# Altium project Clock_Led7_23.PrjPcb
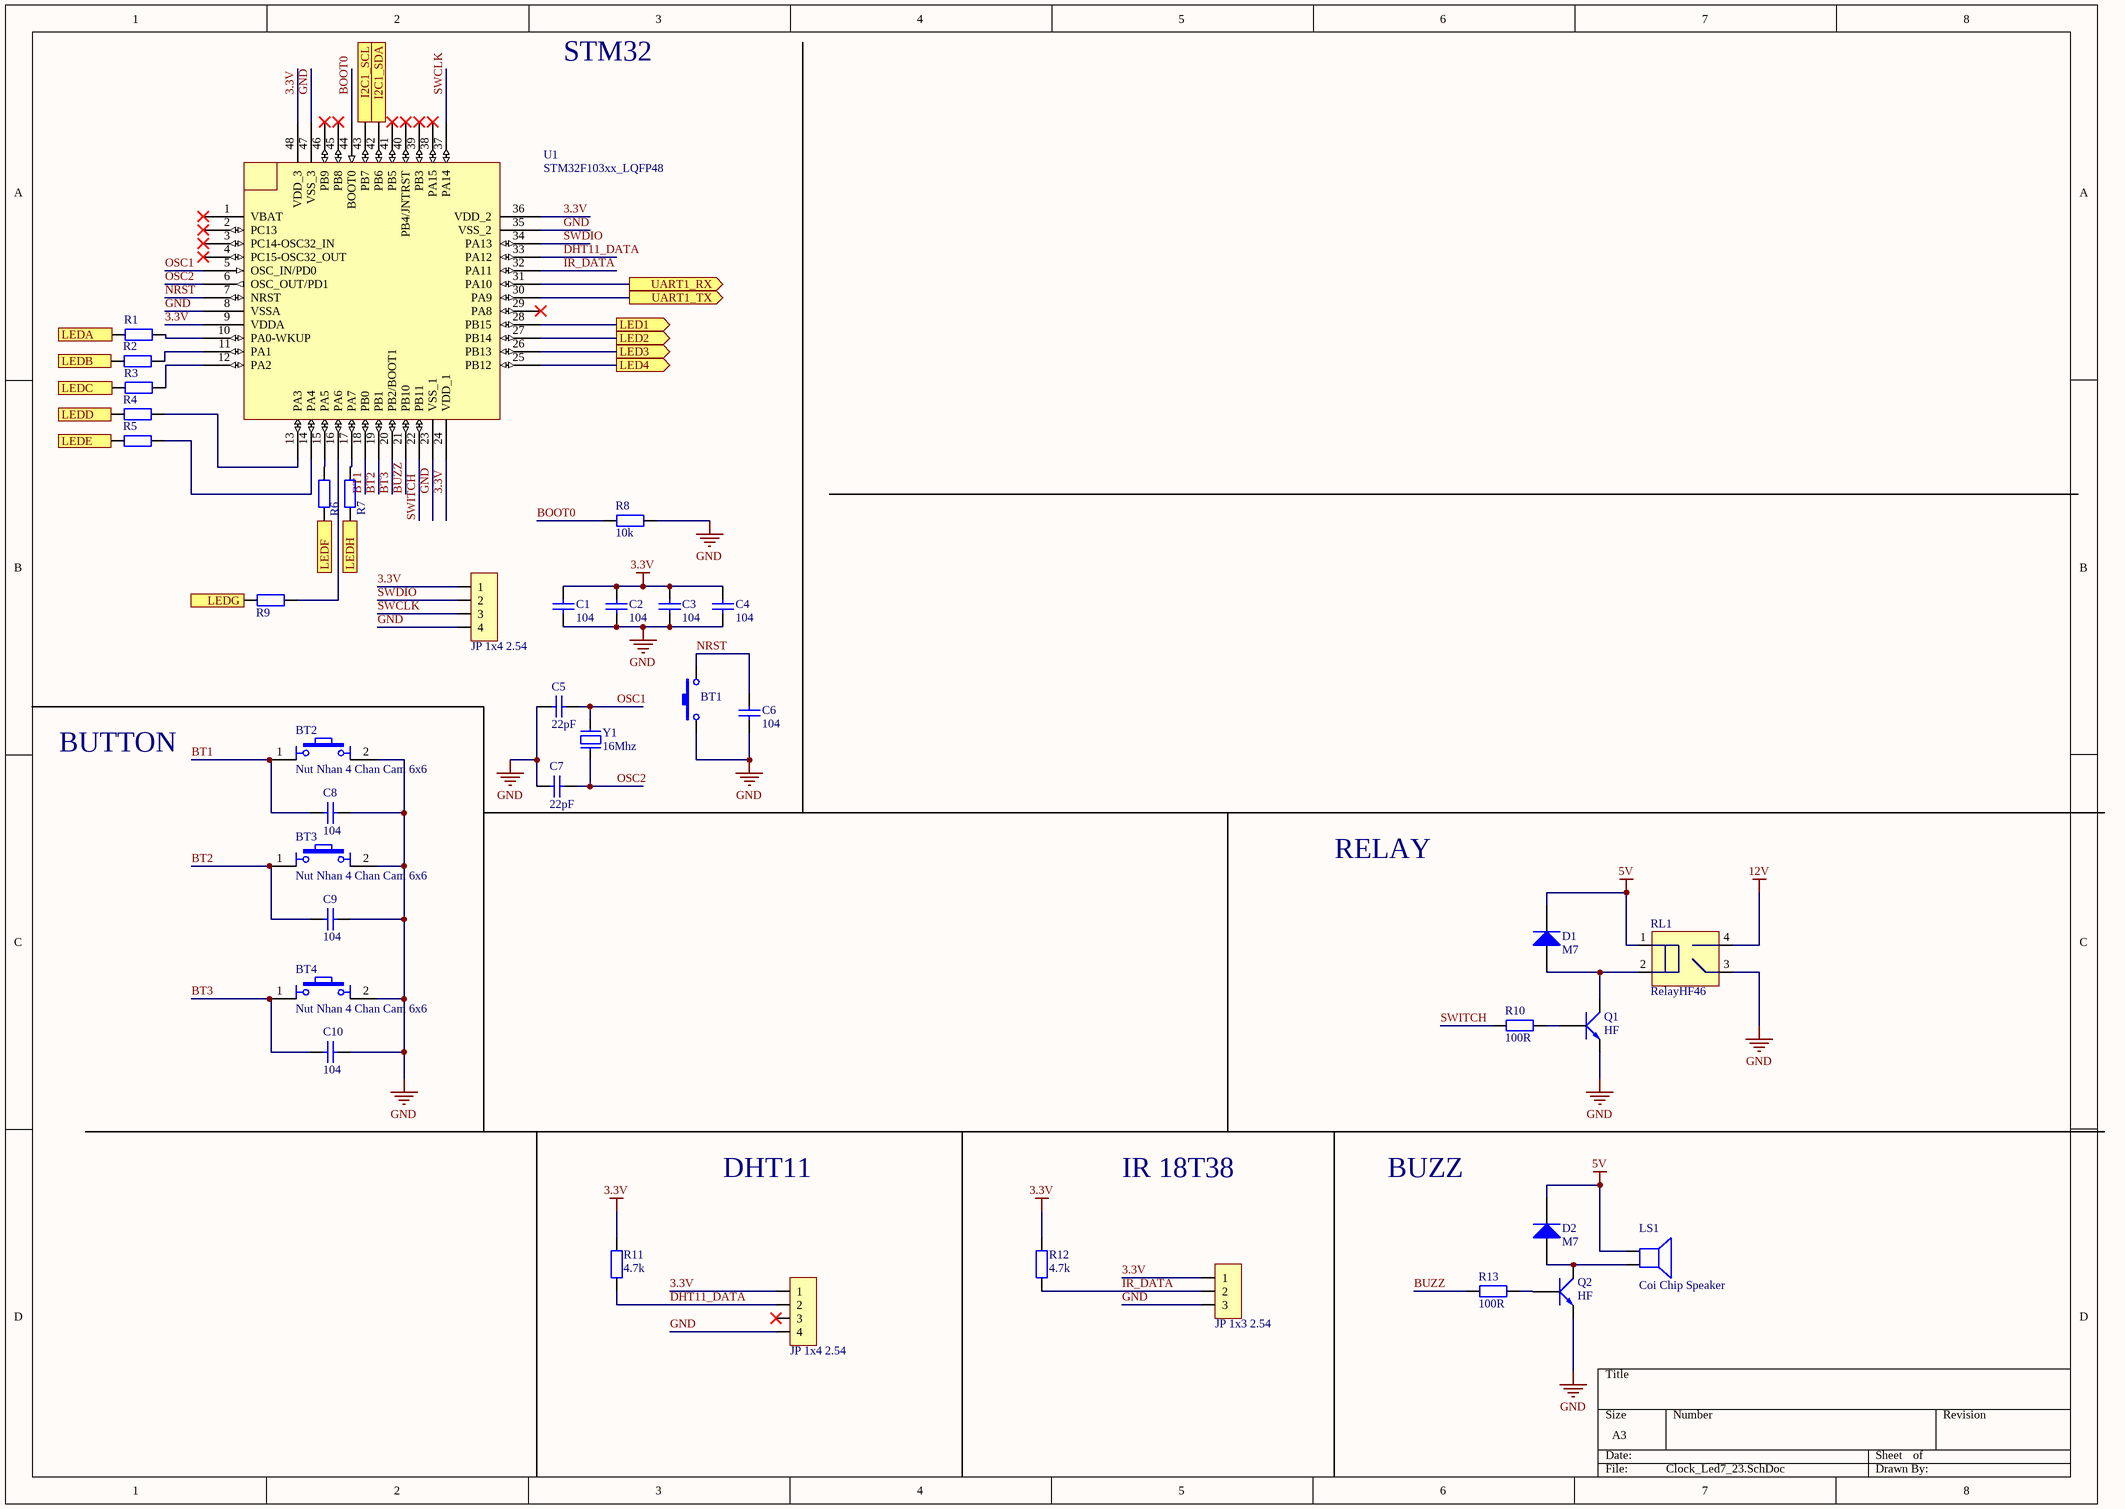
[diagram p0: Clock_Led7_23.SchDoc]
5 sheets, 69 parts. Net scope: flat (ports and power ports of the same name join across sheets).
Board file: Clock_Led7_23.PcbDoc
Sheets:
  Clock_Led7_23.SchDoc
  led7.SchDoc
  DS3231.SchDoc
  ESP8266.SchDoc
  POWER.SchDoc

## Sheet Clock_Led7_23.SchDoc
size A3; SheetNumber: 1; SheetTotal: 1

### Parts
BT1  Nut Nhan 2 Chan SMD 3x6x2.5  [Nut Nhan 2 Chan SMD 3x6x2.5]  (value not drawn)
BT2  Nut Nhan 4 Chan Cam 6x6  [Nut Nhan 4 Chan Cam 6x6]
BT3  Nut Nhan 4 Chan Cam 6x6  [Nut Nhan 4 Chan Cam 6x6]
BT4  Nut Nhan 4 Chan Cam 6x6  [Nut Nhan 4 Chan Cam 6x6]
C1  104  [tu 0805]
C2  104  [tu 0805]
C3  104  [tu 0805]
C4  104  [tu 0805]
C5  22pF  [tu 0805]
C6  104  [tu 0805]
C7  22pF  [tu 0805]
C8  104  [tu 0805]
C9  104  [tu 0805]
C10  104  [tu 0805]
D1  M7  [DIODE SMA]
D2  M7  [DIODE SMA]
JP1  JP 1x4 2.54  [JP 1x4 DT]
JP2  JP 1x3 2.54  [JP 1x3 CT]
JP3  JP 1x4 2.54  [JP 1x4 CT]
LS1  Coi Chip Speaker  [Coi Chip Speacker]
Q1  HF  [SOT23]
Q2  HF  [SOT23]
R1  100R  [tro smd 0805]  (value not drawn)
R2  100R  [tro smd 0805]  (value not drawn)
R3  100R  [tro smd 0805]  (value not drawn)
R4  100R  [tro smd 0805]  (value not drawn)
R5  100R  [tro smd 0805]  (value not drawn)
R6  100R  [tro smd 0805]  (value not drawn)
R7  100R  [tro smd 0805]  (value not drawn)
R8  10k  [tro smd 0805]
R9  100R  [tro smd 0805]  (value not drawn)
R10  100R  [tro smd 0805]
R11  4.7k  [tro smd 0805]
R12  4.7k  [tro smd 0805]
R13  100R  [tro smd 0805]
RL1  RelayHF46  [Relay 4 chan HF46F]
U1  STM32F103xx_LQFP48  [STM32_LQPF48]
Y1  16Mhz  [Thach Anh 2 chan SMD]

### Ports
I2C1_SCL (out), I2C1_SDA (out), LED1 (out), LED2 (out), LED3 (out), LED4 (out), LEDA (out), LEDB (out), LEDC (out), LEDD (out), LEDE (out), LEDF (out), LEDG (out), LEDH (out), UART1_RX (out), UART1_TX (out)

### Nets
3.3V: C1.1 C2.1 C3.1 C4.1 JP1.1 JP2.1 JP3.1 R11.2 R12.2 U1.9(VDDA) U1.24(VDD_1) U1.36(VDD_2) U1.48(VDD_3)
5V: D1.2(K) D2.2(K) LS1.1 RL1.1
12V: RL1.4(AC/DC)
GND: BT1.1 BT2.2 BT3.2 BT4.2 C1.2 C2.2 C3.2 C4.2 C5.2 C6.2 C7.1 C8.2 C9.2 C10.2 JP1.4 JP2.3 JP3.4 Q1.2(E) Q2.2(E) R8.1 RL1.3(AC/DC) U1.8(VSSA) U1.23(VSS_1) U1.35(VSS_2) U1.47(VSS_3)
BOOT0: R8.2 U1.44(BOOT0)
BT1: BT2.1 C8.1 U1.18(PB0)
BT2: BT3.1 C9.1 U1.19(PB1)
BT3: BT4.1 C10.1 U1.20(PB2/BOOT1)
BUZZ: R13.1 U1.21(PB10)
DHT11_DATA: JP3.2 R11.1 U1.33(PA12)
IR_DATA: JP2.2 R12.1 U1.32(PA11)
NRST: BT1.2 C6.1 U1.7(NRST)
OSC1: C5.1 U1.5(OSC_IN/PD0) Y1.2
OSC2: C7.2 U1.6(OSC_OUT/PD1) Y1.1
SWCLK: JP1.3 U1.37(PA14)
SWDIO: JP1.2 U1.34(PA13)
SWITCH: R10.1 U1.22(PB11)
NetD1_1: D1.1(A) Q1.3(C) RL1.2
NetD2_1: D2.1(A) LS1.2 Q2.3(C)
NetL1_2: R5.1 ; port LEDE
NetL1_3: R4.1 ; port LEDD
NetL1_4: R3.1 ; port LEDC
NetL1_6: R2.1 ; port LEDB
NetL1_7: R1.1 ; port LEDA
NetL1_8: R7.1 ; port LEDH
NetL1_9: R6.1 ; port LEDF
NetL1_10: R9.2 ; port LEDG
NetMD1_1: U1.30(PA9) ; port UART1_TX
NetMD1_8: U1.31(PA10) ; port UART1_RX
NetQ1_1: Q1.1(B) R10.2
NetQ2_1: Q2.1(B) R13.2
NetR1_2: R1.2 U1.10(PA0-WKUP)
NetR2_2: R2.2 U1.11(PA1)
NetR3_2: R3.2 U1.12(PA2)
NetR4_2: R4.2 U1.13(PA3)
NetR5_2: R5.2 U1.14(PA4)
NetR6_2: R6.2 U1.15(PA5)
NetR7_2: R7.2 U1.17(PA7)
NetR9_1: R9.1 U1.16(PA6)
NetR16_1: U1.43(PB7) ; port I2C1_SCL
NetR17_1: U1.42(PB6) ; port I2C1_SDA
NetR18_1: U1.28(PB15) ; port LED1
NetR19_1: U1.27(PB14) ; port LED2
NetR20_1: U1.26(PB13) ; port LED3
NetR21_1: U1.25(PB12) ; port LED4

Not connected (* = marked no-connect by the designer): JP3 3*; U1 1(VBAT)* 2(PC13)* 3(PC14-OSC32_IN)* 4(PC15-OSC32_OUT)* 29(PA8)* 38(PA15)* 39(PB3)* 40(PB4/JNTRST)* 41(PB5)* 45(PB8)* 46(PB9)*

### Notes on the sheet
- STM32
- BUTTON
- RELAY
- DHT11
- IR 18T38
- BUZZ

### Library data of the parts
BT1 = Nut Nhan 2 Chan SMD 3x6x2.5: Ma_Hang: MH001036; Ten: Nút Nhấn 2 Chân 3x6x2.5MM SMD
BT2-BT4 = Nut Nhan 4 Chan Cam 6x6: Nut Nhan 4 Chan 6x6mm; Ten: Nút Nhấn 4 Chân 6x6x5MM DIP; Ma_Hang: MH004584
C1-C4 C6 C8-C10 = Tu 0805 104 50V 10%: Dán; Don_Vi: Con; So_Chan: 2; Ten_Linh_Kien: Tụ 0805 104-100nF 10% 50V; Ma_Hang: MH004551; Chung_Loai: Dán; Kieu_Chan: *
C5 C7 = Tu 0805 22pF 50V 10%: Dán; Don_Vi: Con; So_Chan: 2; Ten_Linh_Kien: Tụ 0805 22P 10% 50V; Ma_Hang: MH004560; Chung_Loai: Dán; Kieu_Chan: *
D1 D2 = Diode M7 ( 4007 ): Dán; Don_Vi: Con; Ten_Linh_Kien: Diode M7 1N4007 SMD 1A 1000V; Ma_Hang: MH000944; Chung_Loai: Dán; Ghi_Chu: *
JP1 = JP 1x4 2.54 Duc Thang: Cắm; Ten_Linh_Kien: Jump Đơn Đực 2.54MM 1x40P Thẳng 11MM; Don_Vi: Con; Ma_Hang: MH000903; Ghi_Chu: *; Kieu_Chan: *; Chung_Loai: Cắm
JP2 = JP 1x3 2.54 Cai Thang: Cắm; Ten_Linh_Kien: Jump Đơn Cái 2.54MM 1x20P Thẳng; Don_Vi: Con; Ma_Hang: MH004006; Ghi_Chu: *; Kieu_Chan: *; Chung_Loai: Cắm
JP3 = JP 1x4 2.54 Cai Thang: Cắm; Ten_Linh_Kien: Jump Đơn Cái 2.54MM 1x20P Thẳng; Don_Vi: Con; Ma_Hang: MH004006; Ghi_Chu: *; Kieu_Chan: *; Chung_Loai: Cắm
LS1 = Coi Chip Speaker: Còi chip
Q1 Q2 = C1815 HF SMD: NPN transistor; Value: C9014
R1-R7 R9 R10 R13 = Tro 0805 5% 100R: Dán; Don_Vi: Con; So_Chan: 2; Ten_Linh_Kien: Trở 0805 5% 100R; Ma_Hang: MH005251; Chung_Loai: Dán; Kieu_Chan: *
R8 = Tro 0805 5% 10k: Dán; Don_Vi: Con; So_Chan: 2; Ten_Linh_Kien: Trở 0805 5% 10k; Ma_Hang: MH005239; Chung_Loai: Dán; Kieu_Chan: *
R11 R12 = Tro 0805 5% 4.7k: Dán; Don_Vi: Con; So_Chan: 2; Ten_Linh_Kien: Trở 0805 5% 4.7k; Ma_Hang: MH005307; Chung_Loai: Dán; Kieu_Chan: *
RL1 = Relay 4 chan HF46F: Ten: Relay 5V5A HF46F-G 5-HS1; Ma_Hang: MH003879
Y1 = Thach Anh 2 chan SMD: Crystal For all Crystal 2pin.; Value: 4Mhz
U1 = STM32F103xx_LQFP48: Published: 30-May-2008; DatasheetVersion: rev6, Mar-2008; PackageVersion: Mar-2008; PackageReference: LQFP48; Publisher: Altium Limited; PackageDescription: 48-Pin Low-Profile Quad Flat Pack, 7 x 7 mm Body, 0.5 mm Pitch (LQFP48); ComponentLink1Description: Manufacturer Link; ComponentLink1URL: www.st.com/stm32; ComponentLink2Description: Datasheet; ComponentLink2URL: http://www.st.com/stonline/products/literature/ds/13587.pdf

## Sheet led7.SchDoc
size A4
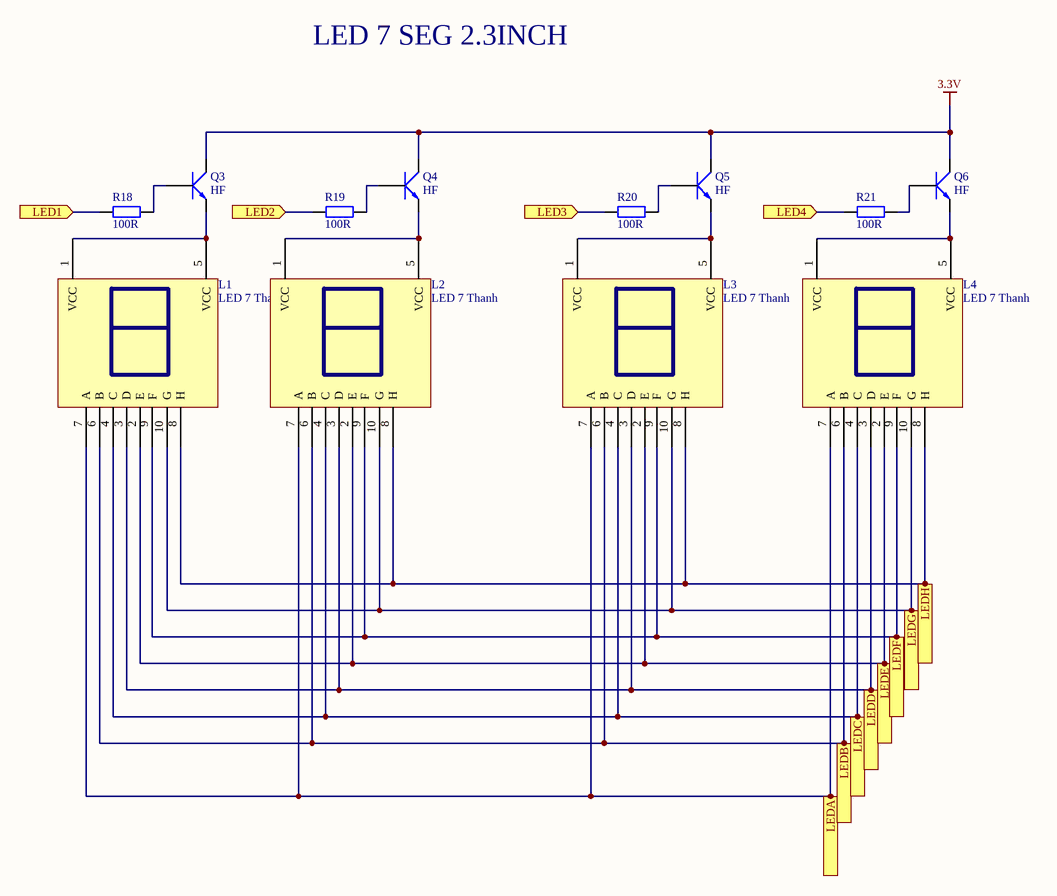
[diagram p1: led7.SchDoc]

### Parts
L1  LED 7 Thanh  [LED7SEG_2.3inch]
L2  LED 7 Thanh  [LED7SEG_2.3inch]
L3  LED 7 Thanh  [LED7SEG_2.3inch]
L4  LED 7 Thanh  [LED7SEG_2.3inch]
Q3  HF  [SOT23]
Q4  HF  [SOT23]
Q5  HF  [SOT23]
Q6  HF  [SOT23]
R18  100R  [tro smd 0805]
R19  100R  [tro smd 0805]
R20  100R  [tro smd 0805]
R21  100R  [tro smd 0805]

### Ports
LED1 (in), LED2 (in), LED3 (in), LED4 (in), LEDA (in), LEDB (in), LEDC (in), LEDD (in), LEDE (in), LEDF (in), LEDG (in), LEDH (in)

### Nets
3.3V: Q3.3(C) Q4.3(C) Q5.3(C) Q6.3(C)
NetL1_2: L1.2(E) L2.2(E) L3.2(E) L4.2(E) ; port LEDE
NetL1_3: L1.3(D) L2.3(D) L3.3(D) L4.3(D) ; port LEDD
NetL1_4: L1.4(C) L2.4(C) L3.4(C) L4.4(C) ; port LEDC
NetL1_5: L1.5(VCC) Q3.2(E)
NetL1_6: L1.6(B) L2.6(B) L3.6(B) L4.6(B) ; port LEDB
NetL1_7: L1.7(A) L2.7(A) L3.7(A) L4.7(A) ; port LEDA
NetL1_8: L1.8(H) L2.8(H) L3.8(H) L4.8(H) ; port LEDH
NetL1_9: L1.9(F) L2.9(F) L3.9(F) L4.9(F) ; port LEDF
NetL1_10: L1.10(G) L2.10(G) L3.10(G) L4.10(G) ; port LEDG
NetL2_5: L2.5(VCC) Q4.2(E)
NetL3_5: L3.5(VCC) Q5.2(E)
NetL4_1: L4.1(VCC) L4.5(VCC) Q6.2(E)
NetQ3_1: Q3.1(B) R18.2
NetQ4_1: Q4.1(B) R19.2
NetQ5_1: Q5.1(B) R20.2
NetQ6_1: Q6.1(B) R21.2
NetR18_1: R18.1 ; port LED1
NetR19_1: R19.1 ; port LED2
NetR20_1: R20.1 ; port LED3
NetR21_1: R21.1 ; port LED4

Not connected (* = marked no-connect by the designer): L1 1(VCC); L2 1(VCC); L3 1(VCC)

### Notes on the sheet
- LED 7 SEG 2.3INCH

### Library data of the parts
L1-L4 = LED 7x1 2.3inch Anot: Dán; Don_Vi: Con; Ma_Hang: MH000901; Ten_Linh_Kien: Led 7 2.3 1 Số Anot (Sáng Đỏ); Ghi_Chu: *; Kieu_Chan: *; Chung_Loai: Dán
Q3-Q6 = C1815 HF SMD: NPN transistor; Value: C9014
R18-R21 = Tro 0805 5% 100R: as R1 on sheet Clock_Led7_23; Chung_Loai: Dán; Kieu_Chan: *

## Sheet DS3231.SchDoc
size A4
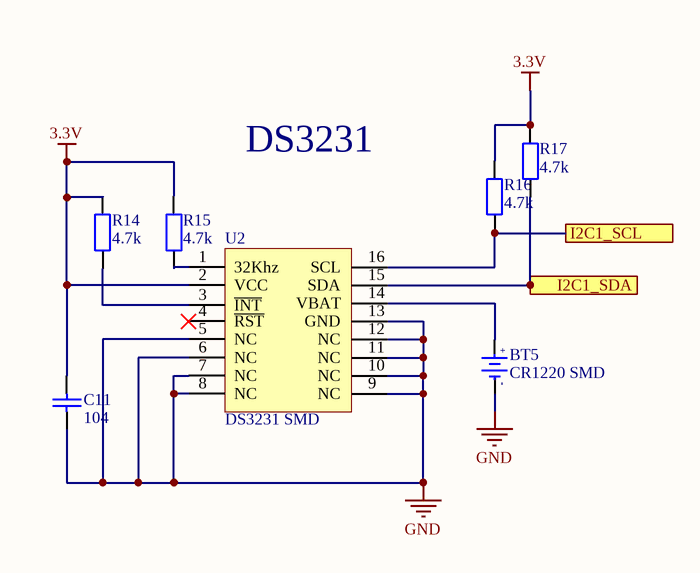
[diagram p2: DS3231.SchDoc]

### Parts
BT5  CR1220 SMD  [DE PIN CR1220]
C11  104  [tu 1206]
R14  4.7k  [tro smd 0805]
R15  4.7k  [tro smd 0805]
R16  4.7k  [tro smd 0805]
R17  4.7k  [tro smd 0805]
U2  DS3231 SMD  [SOIC 16]

### Ports
I2C1_SCL, I2C1_SDA

### Nets
3.3V: C11.1 R14.2 R15.2 R16.2 R17.2 U2.2(VCC)
GND: BT5.2(GND) C11.2 U2.5(NC) U2.6(NC) U2.7(NC) U2.8(NC) U2.9(NC) U2.10(NC) U2.11(NC) U2.12(NC) U2.13(GND)
NetBT5_1: BT5.1(+3V) U2.14(VBAT)
NetR14_1: R14.1 U2.3(~{INT})
NetR15_1: R15.1 U2.1(32Khz)
NetR16_1: R16.1 U2.16(SCL) ; port I2C1_SCL
NetR17_1: R17.1 U2.15(SDA) ; port I2C1_SDA

Not connected (* = marked no-connect by the designer): U2 4(~{RST})*

### Notes on the sheet
- DS3231
- (in symbol De pin CR1220 SMD) +; -

### Library data of the parts
BT5 = De pin CR1220 SMD: Ten: Đế PIN CR1220 SMD; Ma_Hang: MH000833
C11 = Tu 1206 104 50V 20%: Dán; Don_Vi: Con; So_Chan: 2; Ten_Linh_Kien: Tụ 1206 104-0.1uF 20% 50V; Ma_Hang: MH004544; Chung_Loai: Dán; Kieu_Chan: *
R14-R17 = Tro 0805 5% 4.7k: as R11 on sheet Clock_Led7_23; Chung_Loai: Dán; Kieu_Chan: *
U2 = DS3231 SMD: SOIC

## Sheet ESP8266.SchDoc
size A4
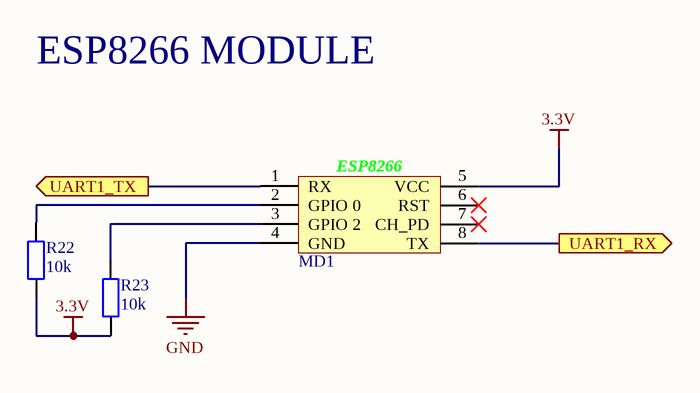
[diagram p3: ESP8266.SchDoc]

### Parts
MD1  ESP8266 Module  [ESP2866 Module]  (value not drawn)
R22  10k  [tro smd 0805]
R23  10k  [tro smd 0805]

### Ports
UART1_RX (out), UART1_TX (out)

### Nets
3.3V: MD1.5(VCC) R22.1 R23.1
GND: MD1.4(GND)
NetMD1_1: MD1.1(RX) ; port UART1_TX
NetMD1_2: MD1.2(GPIO_0) R22.2
NetMD1_3: MD1.3(GPIO_2) R23.2
NetMD1_8: MD1.8(TX) ; port UART1_RX

Not connected (* = marked no-connect by the designer): MD1 6(RST)* 7(CH_PD)*

### Notes on the sheet
- ESP8266 MODULE
- (in symbol ESP8266 Module) ESP8266

### Library data of the parts
R22 R23 = Tro 0805 5% 10k: as R8 on sheet Clock_Led7_23; Chung_Loai: Dán; Kieu_Chan: *

## Sheet POWER.SchDoc
size A4
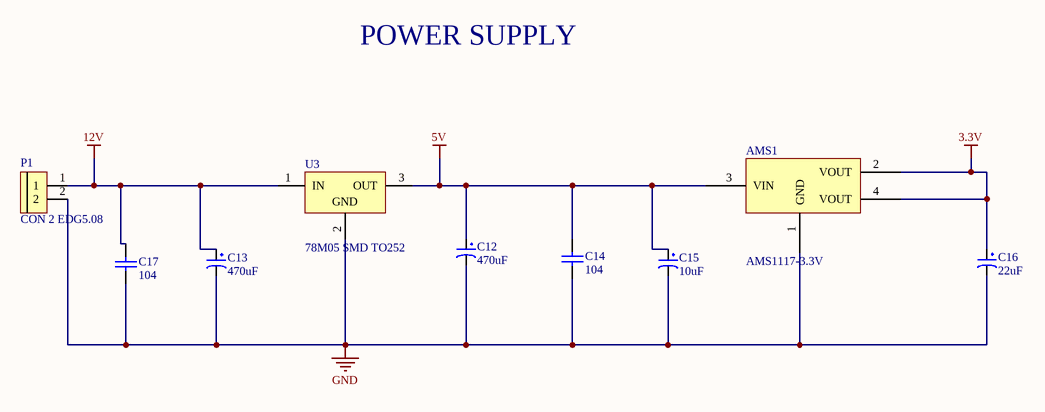
[diagram p4: POWER.SchDoc]

### Parts
AMS1  AMS1117-3.3V  [SOT223]
C12  470uF  [tu hoa 8mm]
C13  470uF  [tu hoa 8mm]
C14  104  [tu 1206]
C15  10uF  [tu tantalum smd3216]
C16  22uF  [tu tantalum smd6032]
C17  104  [tu 1206]
P1  CON 2 EDG5.08  [CON 2 2EDG5.08]
U3  78M05 SMD TO252  [TO252]

### Nets
3.3V: AMS1.2(VOUT) AMS1.4(VOUT) C16.1
5V: AMS1.3(VIN) C12.1 C14.1 C15.1 U3.3(OUT)
12V: C13.1 C17.1 P1.1 U3.1(IN)
GND: AMS1.1(GND) C12.2 C13.2 C14.2 C15.2 C16.2 C17.2 P1.2 U3.2(GND)

### Notes on the sheet
- POWER SUPPLY

### Library data of the parts
AMS1 = AMS1117 SMD: Dán; Value: AMS1117-3.3V SOT223; Don_Vi: Con; Ma_Hang: MH000596; Ghi_Chu: *; Kieu_Chan: *; Chung_Loai: Dán
C12 C13 = Tu Hoa 470uF 16V 8x11: Cắm; Don_Vi: Con; So_Chan: 2; Ten_Linh_Kien: Tụ Hóa 470uF 16V 8x11MM; Ma_Hang: MH006550; Chung_Loai: Cắm; Kieu_Chan: *
C14 C17 = Tu 1206 104 50V 20%: as C11 on sheet DS3231; Chung_Loai: Dán; Kieu_Chan: *
C15 = Tu tantalum 10uF 16V SMD3216: Dán; Don_Vi: Con; So_Chan: 2; Ten_Linh_Kien: Tụ tantalum 106C-10uF 16V SMD3216; Ma_Hang: MH001954; Chung_Loai: Dán; Kieu_Chan: *
C16 = Tu tantalum 22uF 25V SMD6032: Dán; Don_Vi: Con; So_Chan: 2; Ten_Linh_Kien: Tụ tantalum 226E-22uF 25V SMD6032; Ma_Hang: MH002651; Chung_Loai: Dán; Kieu_Chan: *
P1 = CON 2 EDG5.08: Cắm; Ten_Linh_Kien: CON 2 2EDG5.08-2P 5.08MM ( Xanh Cong); Ma_Hang: MH000759; Ghi_Chu: *; Don_Vi: Con; Kieu_Chan: *; Chung_Loai: Cắm
U3 = 78M05 SMD TO252: Dán; Don_Vi: Con; Ten_Linh_Kien: 78M05 TO252; Ma_Hang: MH001917; Ghi_Chu: *; Kieu_Chan: *; Chung_Loai: Dán

## Nets that join several sheets
3.3V: Clock_Led7_23 (13 pins), led7 (Q3.3 Q4.3 Q5.3 Q6.3), DS3231 (6 pins), ESP8266 (MD1.5 R22.1 R23.1), POWER (AMS1.2 AMS1.4 C16.1)
5V: Clock_Led7_23 (D1.2 D2.2 LS1.1 RL1.1), POWER (5 pins)
12V: Clock_Led7_23 (RL1.4), POWER (C13.1 C17.1 P1.1 U3.1)
GND: Clock_Led7_23 (25 pins), DS3231 (11 pins), ESP8266 (MD1.4), POWER (9 pins)
NetL1_2: Clock_Led7_23 (R5.1), led7 (L1.2 L2.2 L3.2 L4.2)
NetL1_3: Clock_Led7_23 (R4.1), led7 (L1.3 L2.3 L3.3 L4.3)
NetL1_4: Clock_Led7_23 (R3.1), led7 (L1.4 L2.4 L3.4 L4.4)
NetL1_6: Clock_Led7_23 (R2.1), led7 (L1.6 L2.6 L3.6 L4.6)
NetL1_7: Clock_Led7_23 (R1.1), led7 (L1.7 L2.7 L3.7 L4.7)
NetL1_8: Clock_Led7_23 (R7.1), led7 (L1.8 L2.8 L3.8 L4.8)
NetL1_9: Clock_Led7_23 (R6.1), led7 (L1.9 L2.9 L3.9 L4.9)
NetL1_10: Clock_Led7_23 (R9.2), led7 (L1.10 L2.10 L3.10 L4.10)
NetMD1_1: Clock_Led7_23 (U1.30), ESP8266 (MD1.1)
NetMD1_8: Clock_Led7_23 (U1.31), ESP8266 (MD1.8)
NetR16_1: Clock_Led7_23 (U1.43), DS3231 (R16.1 U2.16)
NetR17_1: Clock_Led7_23 (U1.42), DS3231 (R17.1 U2.15)
NetR18_1: Clock_Led7_23 (U1.28), led7 (R18.1)
NetR19_1: Clock_Led7_23 (U1.27), led7 (R19.1)
NetR20_1: Clock_Led7_23 (U1.26), led7 (R20.1)
NetR21_1: Clock_Led7_23 (U1.25), led7 (R21.1)